# EasyEDA schematic SCH_pov display.json
TITLE: Sheet_1; REV: 1.0; Date: 2021-11-20; Sheet: 1/1; Company: Your Company
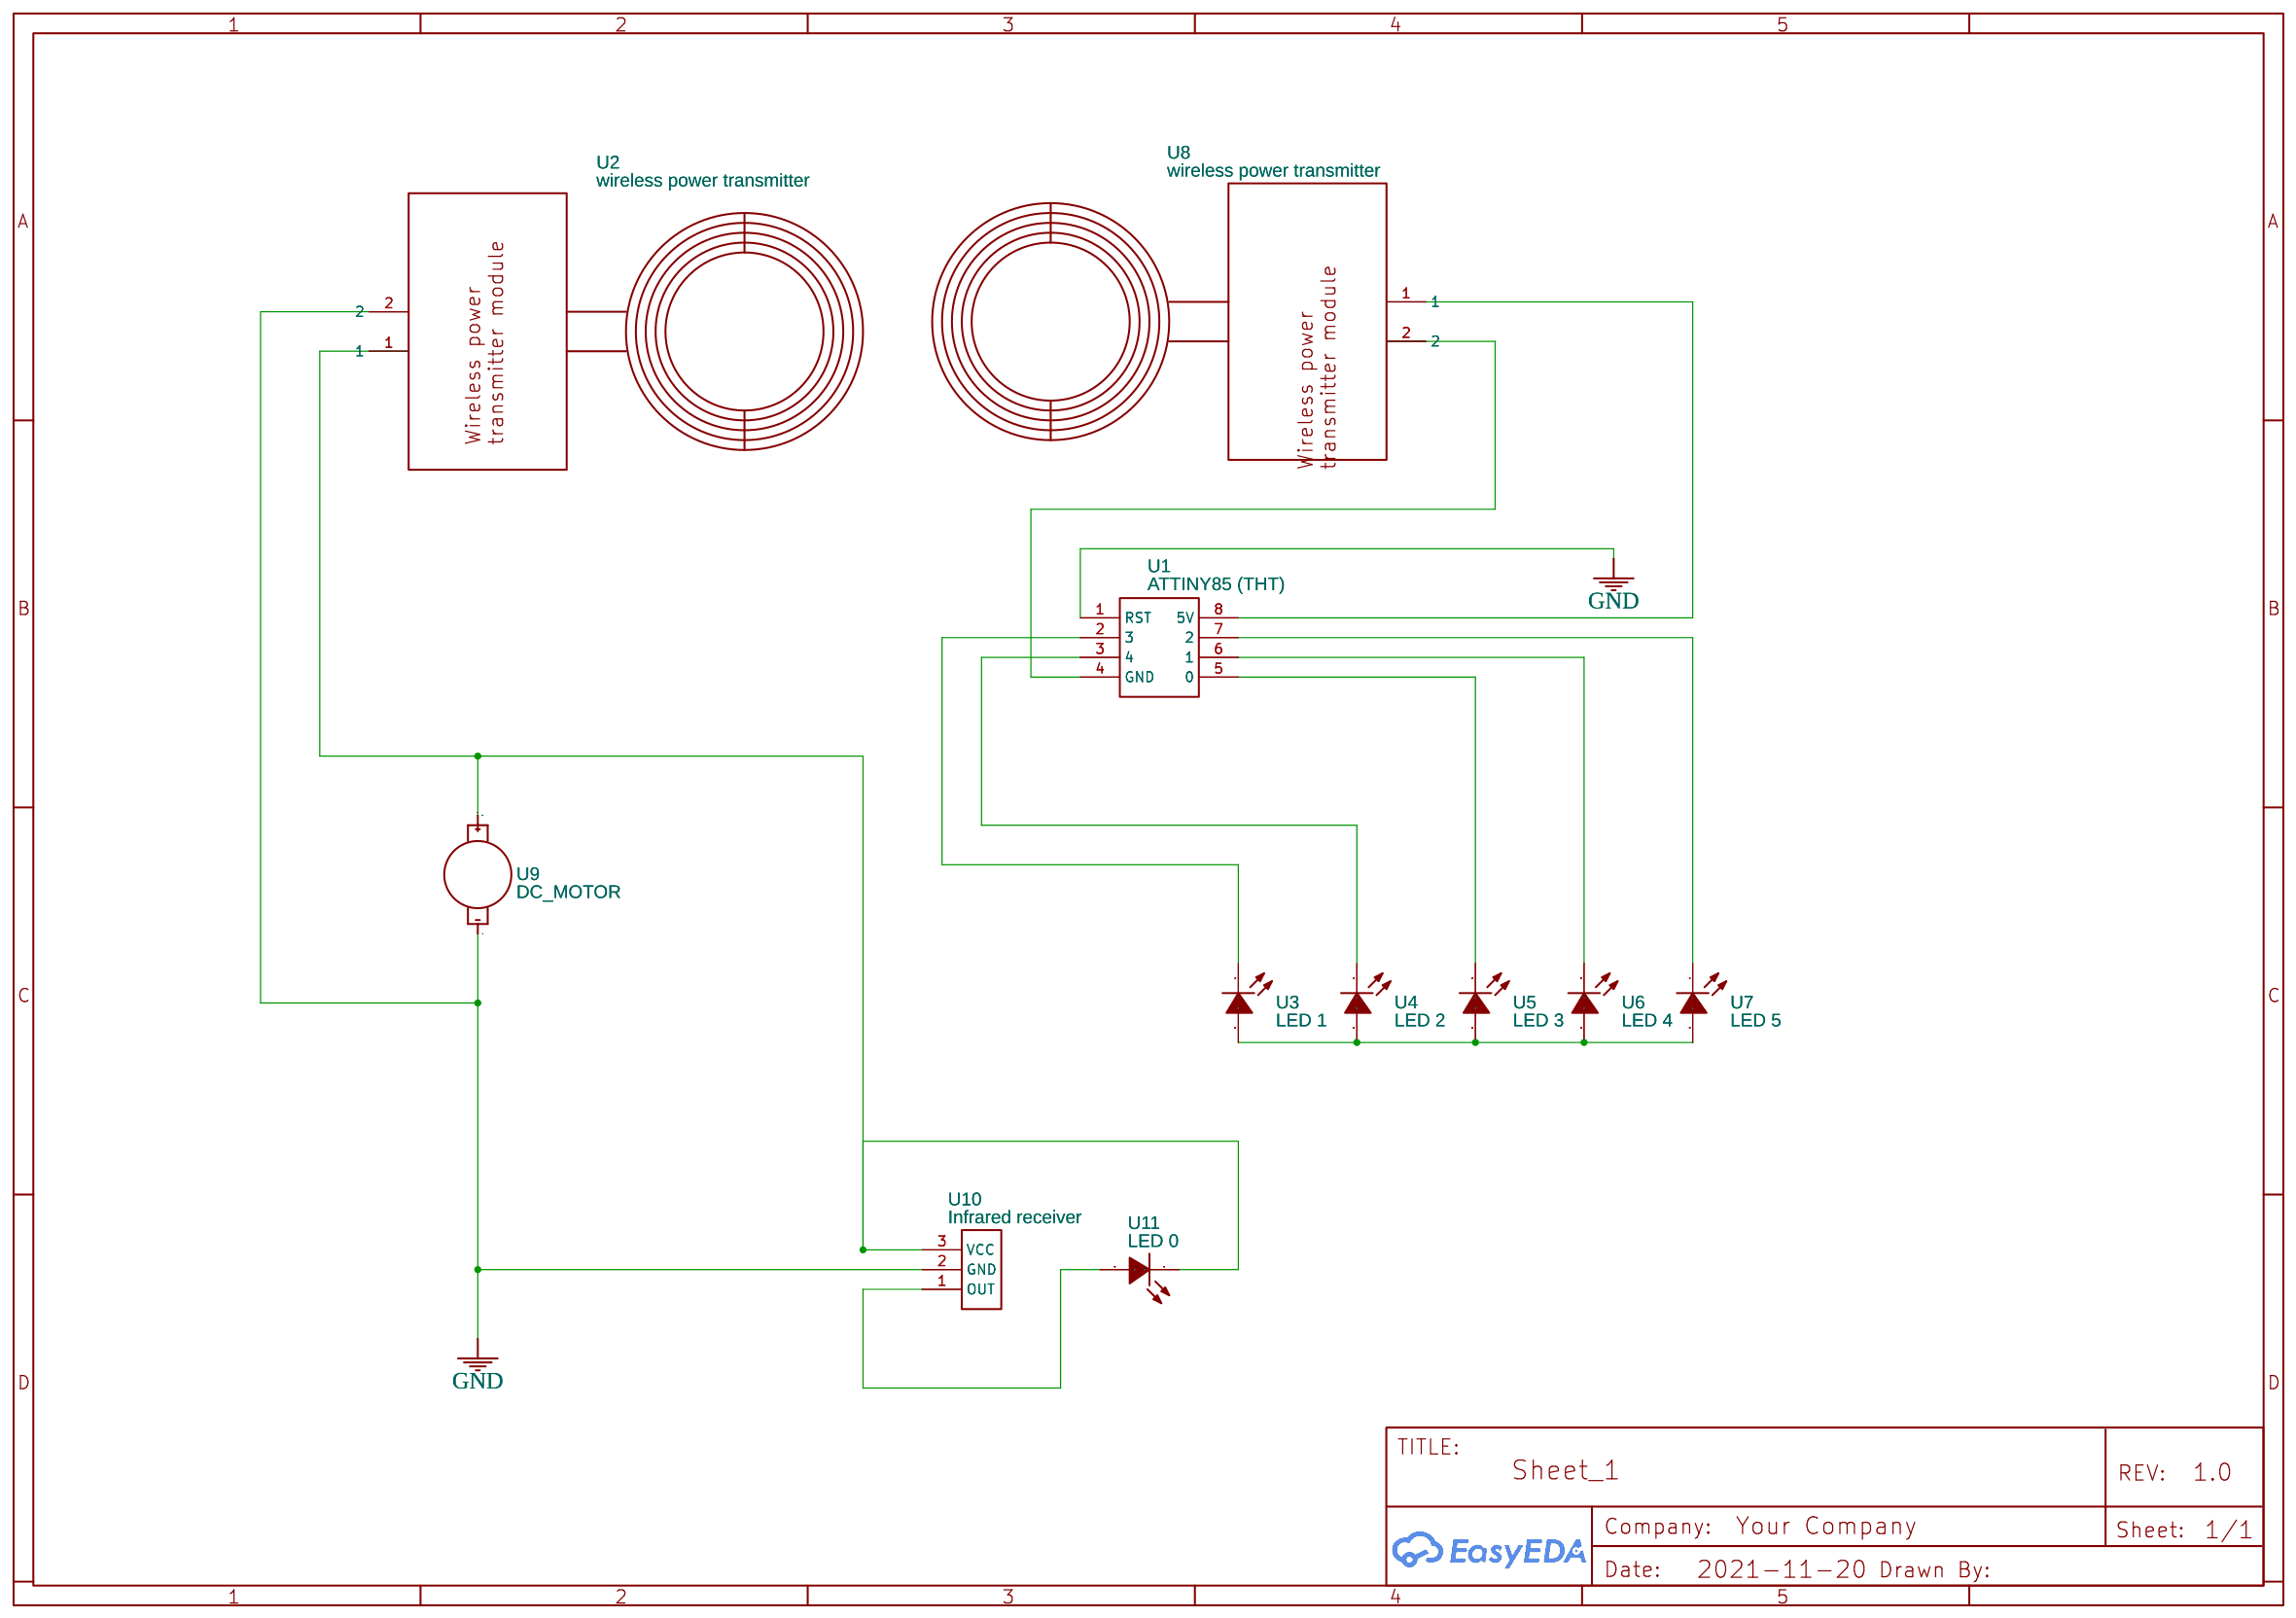
[diagram p0: schematic sheet]

## Parts
U1  ATTINY85 (THT)  [ATTINY85]
U2  wireless power transmitter
U3  LED 1  [LED0805-RD]
U4  LED 2  [LED0805-RD]
U5  LED 3  [LED0805-RD]
U6  LED 4  [LED0805-RD]
U7  LED 5  [LED0805-RD]
U8  wireless power transmitter
U9  DC_MOTOR  [VIBE-MOTOR-10MM]
U10  Infrared receiver  [INFRARED SENSOR]
U11  LED 0  [LED0603-RD]

## Library data of the parts
U1 = ATTINY85 (THT): Manufacturer Part: ATTINY85-20PU; Supplier Part: 1455162; Supplier: Element14; link: http://au.element14.com/atmel/attiny85-20pu/mcu-8bit-attiny-20mhz-dip-8/dp/1455162; Contributor: AutogolazzoJr
U2 U8 = wireless power transmitter: Contributor: shreyas shah
U3-U7 = 17-21SURC/S530-A2/TR8(ES): Supplier: LCSC; Supplier Part: C2840101; Manufacturer: null; JLCPCB Part Class: Extended Part; Contributor: LCSC
U9 = DC_MOTOR: Contributor: Gianluca Tenni
U10 = Infrared receiver: Contributor: Rayzecks
U11 = DCS-C0603W-DWJ/F01: Supplier: LCSC; Supplier Part: C2830755; Manufacturer: null; Contributor: LCSC; JLCPCB Part Class: Extended Part

## Nets
GND: U1.1(RST) U2.2 U9.- U10.2(GND)
Net-(U1-2): U1.2(3) U3.1(-)
Net-(U1-3): U1.3(4) U4.1(-)
Net-(U1-4): U1.4(GND) U8.2
Net-(U1-5): U1.5(0) U5.1(-)
Net-(U1-6): U1.6(1) U6.1(-)
Net-(U1-7): U1.7(2) U7.1(-)
Net-(U1-8): U1.8(5V) U8.1
Net-(U2-1): U2.1 U9.+ U10.3(VCC) U11.1(-)
Net-(U3-2): U3.2(+) U4.2(+) U5.2(+) U6.2(+) U7.2(+)
Net-(U10-1): U10.1(OUT) U11.2(+)
